# Altium project PCB_LED.PrjPcb
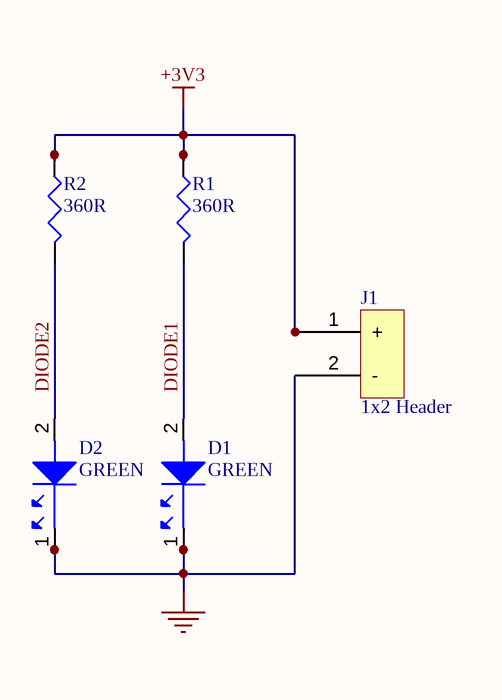
[diagram p0: LED.SchDoc]
1 sheet, 5 parts. Net scope: global (net labels, ports and power ports of the same name join across sheets).
Board file: LED.PcbDoc

## Sheet LED.SchDoc: Sample circuit LED
size 420 x 297 mm; Date: 04/05/2023; DrawnBy: Dilini; Organization: SLT; SheetNumber: 1; SheetTotal: 1

### Parts
D1  GREEN  [LED0603G]
D2  GREEN  [LED0603G]
J1  1x2 Header  [HDR1x2]
R1  360R  [R0805]
R2  360R  [R0805]

### Nets
+3V3: J1.1(+) R1.1 R2.1
GND: D1.1 D2.1 J1.2(-)
DIODE1: D1.2 R1.2
DIODE2: D2.2 R2.2

### Notes on the sheet
- THIS DOCUMENT AND THE DATA DISCLOSED HEREIN OR
- HEREWITH IS THE PROPERTY OF ALTIUM LIMITED AND MAY
- DWG NO:
- REVISION
- REV:
- DESCRIPTION
- DATE
- APPROVED
- BE FREELY DISTRIBUTED IN WHOLE. NO RIGHTS ARE
- RESERVED OR EXPRESS OR IMPLIED WARANTEE GIVEN.
- ENG:
- APPROVALS
- PROJECT
- DSN:
- CHK:
- REFERENCE DOCUMENTS
- PROJECT REVISION:
- TITLE
- DOCUMENT REVISION:
- DESIGN ITEM:
- BOM:
- FAB DWG:
- PCB DWG:
- ASSY DWG:
- SCALE:
- A3
- SIZE
- CAGE CODE
- FILE NAME
- DWG NO.
- SHEET
- OF
- REV

### Library data of the parts
D1 D2 = LSM0603453V: LED SM 0603 3V -/1000/-MCD GREEN; Manufacturer: Visual Communications; Lens Color: Colorless; Lens Style: Flat; Lens Transparency: Clear; Luminous Intensity: 63mcd; Forward Voltage: 2V; Test Current: 20mA; Viewing Angle: 120°; Dominant Wavelength: 572nm; Lens Size: 0.8mm; Supplier: Digi-Key; Manufacturer Part Number: LSM0603453V; RoHS: Yes; Category: LEDs; Stock: 90741; Pricing: 1=0.4, 10=0.247, 100=0.1421, 1000=0.11124, 2000=0.10197 (USD); Mounting Technology: Surface Mount; Case/Package: 0603; Color: Green; Case Code (Imperial): 0603; Case Code (Metric): 1608; Packaging: Cut Tape; Series: LSM0603; Length: 1.6mm; Width: 0.8mm; Height: 0.65mm; RoHS Compliant: Yes; ComponentLink1URL: http://www.farnell.com/datasheets/2699708.pdf?src-supplier=Farnell; ComponentLink1Description: http://www.farnell.com/datasheets/2699708.pdf?src-supplier=Farnell; ComponentLink2URL: http://www.farnell.com/datasheets/2699708.pdf?src-supplier=Newark; ComponentLink2Description: http://www.farnell.com/datasheets/2699708.pdf?src-supplier=Newark; ComponentLink3URL: https://vcclite.com/wp-content/uploads/wpallimport/files/files/LSM0603453V.pdf?src-supplier=Digi-Key; ComponentLink3Description: https://vcclite.com/wp-content/uploads/wpallimport/files/files/LSM0603453V.pdf?src-supplier=Digi-Key; Supplier Part Number: LSM0603453VCT-ND
J1 = 22-27-2021: CONN HEADER VERT 2POS 2.54MM; Manufacturer: Molex; Number of Positions: 2; Current Rating: 4A; Gender: Male; Voltage Rating: 500V; Voltage Rating (DC): 250V; Category: Headers and Wire Housings; Stock: 162137; Pricing: 1=0.3, 10=0.245, 100=0.18, 1000=0.14317, 5000=0.12272, 10000=0.11453 (USD); Housing Color: Natural; Housing Material: Nylon; Contact Plating: Tin; Contact Material: Tin; Material: Nylon; Weight: 0.00769oz; Number of Rows: 1; Packaging: Bulk; Termination: Through Hole; Series: 6410; Package Quantity: 24000; Contact Type: -; Contact Gender: Male; Pitch: 2.54mm; RoHS Compliant: Yes; Lead Free: Lead Free; Flammability Rating: UL94 V-0; Manufacturer Part Number: 22-27-2021; Supplier: Digi-Key; RoHS: Yes; Supplier Part Number: WM4111-ND
R1 R2 = AC0805FR-07360RL: RES SMD 360 OHM 1% 1/8W 0805; Manufacturer: Yageo; Max Power Dissipation: 125mW; Temperature Coefficient: 100ppm/°C; Supplier: Digi-Key; Manufacturer Part Number: AC0805FR-07360RL; RoHS: Yes; Category: Chip SMD Resistors; Stock: 12460; Pricing: 1=0.1, 10=0.031, 100=0.0166, 1000=0.00997, 2500=0.00833 (USD); Case/Package: 0805; Min Operating Temperature: -55°C; Max Operating Temperature: 155°C; Tolerance: 1%; Packaging: Tape and Reel; Number of Terminations: 2; Features: Moisture Resistant,Automotive AEC-Q200; Series: AC; Length: 0.079inch; Width: 0.049inch; Height: 0.024inch; RoHS Compliant: Yes; ComponentLink1URL: http://www.yageo.com/NewPortal/yageodocoutput?fileName=/pdf/R-Chip/PYu-AC_51_RoHS_L_6.pdf&src-supplier=Digi-Key; ComponentLink1Description: http://www.yageo.com/NewPortal/yageodocoutput?fileName=/pdf/R-Chip/PYu-AC_51_RoHS_L_6.pdf&src-supplier=Digi-Key; Value: 360R; Supplier Part Number: 13-AC0805FR-07360RLCT-ND